# Altium project IMOB_TAG_hv1.PrjPcb
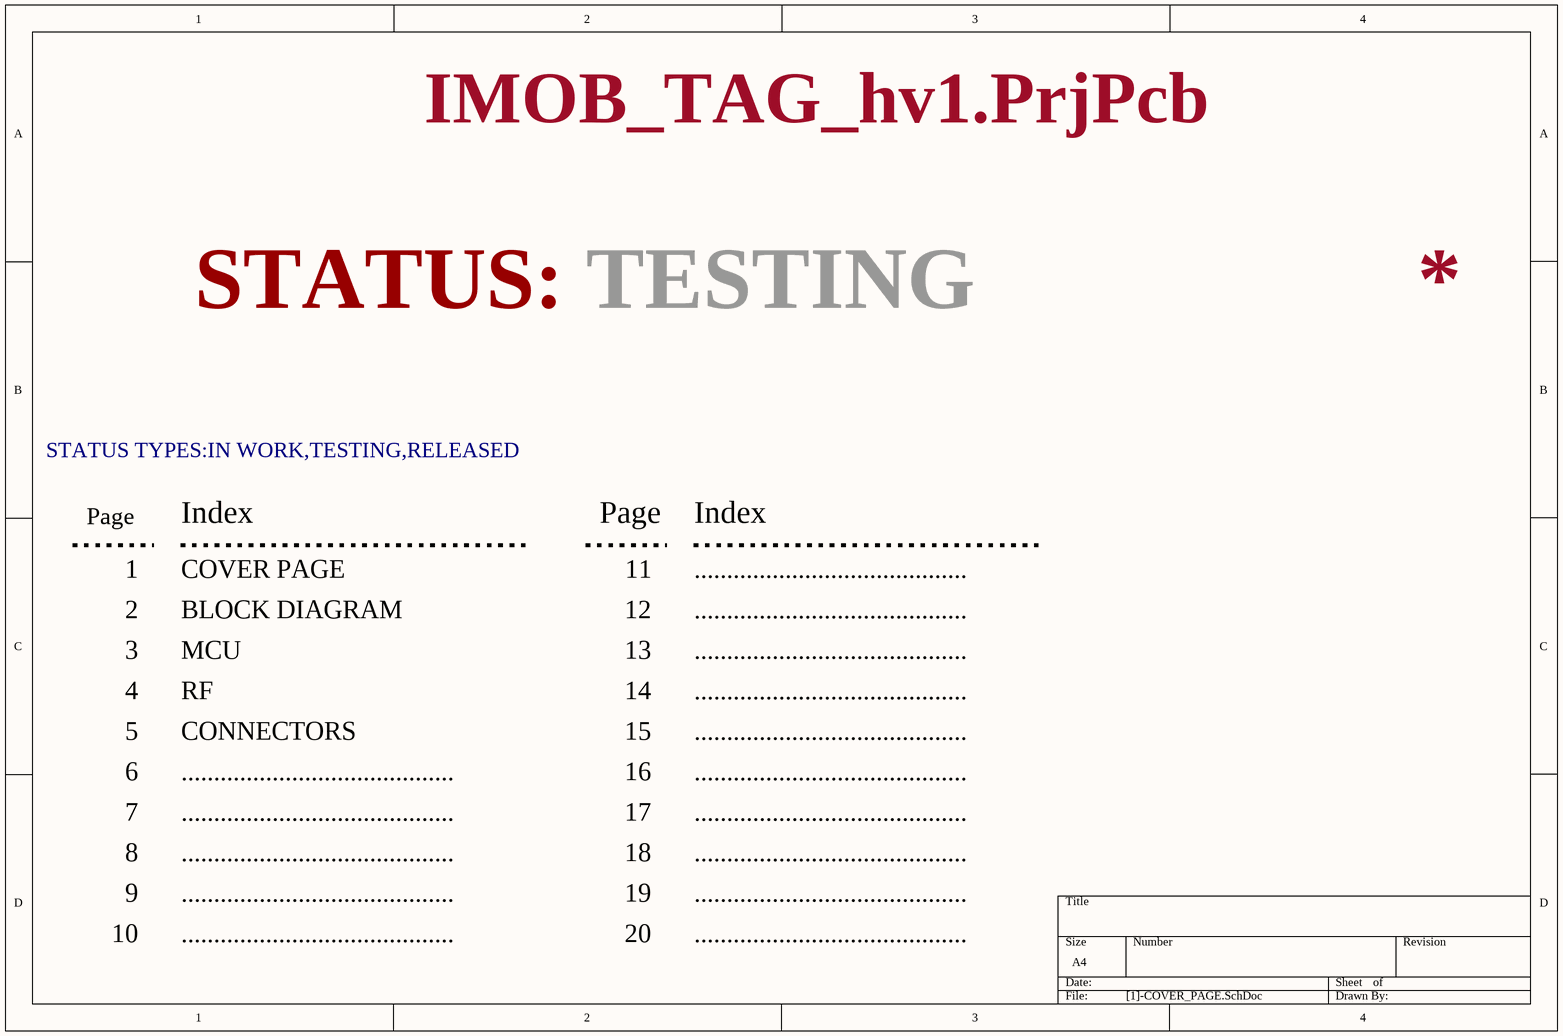
[diagram p0: [1]-COVER_PAGE.SchDoc]
4 sheets, 45 parts. Net scope: flat (ports and power ports of the same name join across sheets).
Board file: IMOB_TAG_hv1.PcbDoc
Sheets:
  [1]-COVER_PAGE.SchDoc
  [3]-MCU.SchDoc
  [4]-RF.SchDoc
  [5]-CONNECTORS.SchDoc

## Sheet [1]-COVER_PAGE.SchDoc
size A4

### Notes on the sheet
- STATUS:
- TESTING
- STATUS TYPES:IN WORK,TESTING,RELEASED
- Page
- 1
- Index
- COVER PAGE
- 11
- ..........................................
- 2
- BLOCK DIAGRAM
- 12
- 3
- 4
- MCU
- RF
- 13
- 14
- 5
- 6
- CONNECTORS
- 15
- 16
- 7
- 17
- 8
- 9
- 18
- 19
- 10
- 20

## Sheet [3]-MCU.SchDoc
size A4
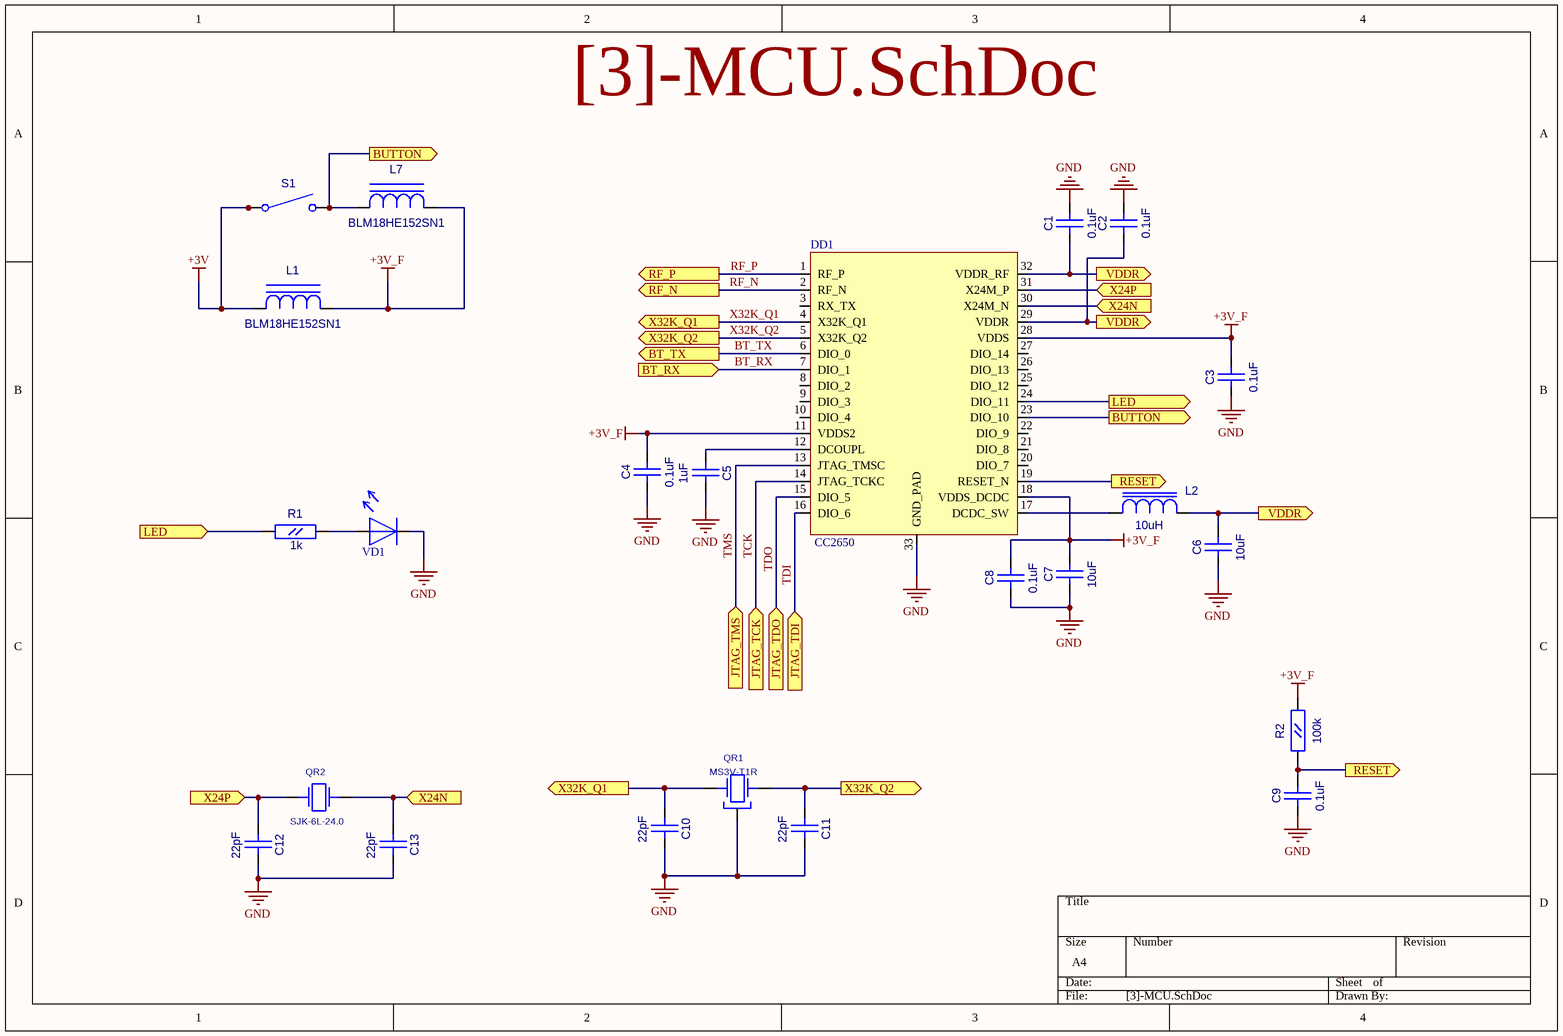
[diagram p1: [3]-MCU.SchDoc]

### Parts
C1  0.1uF  [CC0603]
C2  0.1uF  [CC0603]
C3  0.1uF  [CC0603]
C4  0.1uF  [CC0603]
C5  1uF  [CC0603]
C6  10uF  [CC0805]
C7  10uF  [CC0805]
C8  0.1uF  [CC0603]
C9  0.1uF  [CC0603]
C10  22pF  [CC0603]
C11  22pF  [CC0603]
C12  22pF  [CC0603]
C13  22pF  [CC0603]
DD1  CC2650  [QFN32_TI]
L1  BLM18HE152SN1  [L0603]
L2  10uH  [RC0805]
L7  BLM18HE152SN1  [L0603]
QR1  MS3V-T1R  [MS3V-T1R]
QR2  SJK-6L-24.0  [AC5032_2]
R1  1k  [RC0603]
R2  100k  [RC0603]
S1  IT-1147  [IT-1147]  (value not drawn)
VD1  LED_0805  [LED0805]  (value not drawn)

### Ports
BT_RX (in), BT_TX (out), BUTTON (out), JTAG_TCK (in), JTAG_TDI (in), JTAG_TDO (in), JTAG_TMS (in), LED (in), LED (out), RESET (out), RF_N (out), RF_P (out), VDDR (out), X24N (in), X24P (in), X32K_Q1 (out), X32K_Q2 (out)

### Nets
+3V: L1.1(A) S1.1(C1) S1.2
+3V_F: C3.2(B) C4.2(B) C7.2(B) C8.2(B) DD1.11(VDDS2) DD1.18(VDDS_DCDC) DD1.28(VDDS) L1.2(C) L7.2(C) R2.2(B)
GND: C1.2(B) C2.2(B) C3.1(A) C4.1(A) C5.2(B) C6.1(A) C7.1(A) C8.1(A) C9.1(A) C10.2(B) C11.2(B) C12.2(B) C13.2(B) DD1.33(GND_PAD) QR1.3 VD1.2
BT_RX: DD1.7(DIO_1) ; port BT_RX
BT_TX: DD1.6(DIO_0) ; port BT_TX
RF_N: DD1.2(RF_N) ; port RF_N
RF_P: DD1.1(RF_P) ; port RF_P
TCK: DD1.14(JTAG_TCKC) ; port JTAG_TCK
TDI: DD1.16(DIO_6) ; port JTAG_TDI
TDO: DD1.15(DIO_5) ; port JTAG_TDO
TMS: DD1.13(JTAG_TMSC) ; port JTAG_TMS
X32K_Q1: C10.1(A) DD1.4(X32K_Q1) QR1.2(X2) ; port X32K_Q1
X32K_Q2: C11.1(A) DD1.5(X32K_Q2) QR1.1(X1) ; port X32K_Q2
NetC1_1: C1.1(A) C2.1(A) C6.2(B) DD1.29(VDDR) DD1.32(VDDR_RF) L2.2(B) ; port VDDR
NetC5_1: C5.1(A) DD1.12(DCOUPL)
NetC9_2: C9.2(B) DD1.19(RESET_N) R2.1(A) ; port RESET
NetC12_1: C12.1(A) DD1.31(X24M_P) QR2.1 ; port X24P
NetC13_1: C13.1(A) DD1.30(X24M_N) QR2.2 ; port X24N
NetDD1_17: DD1.17(DCDC_SW) L2.1(A)
NetDD1_23: DD1.23(DIO_10) L7.1(A) S1.3(C2) S1.4 ; port BUTTON
NetDD1_24: DD1.24(DIO_11) R1.1(A) ; port LED
NetR1_2: R1.2(B) VD1.1

Not connected (* = marked no-connect by the designer): DD1 3(RX_TX) 8(DIO_2) 9(DIO_3) 10(DIO_4) 20(DIO_7) 21(DIO_8) 22(DIO_9) 25(DIO_12) 26(DIO_13) 27(DIO_14)

### Library data of the parts
C1-C5 C8-C13 = CC0603
  C1-C4 C8 C9: Value: 0.1uF
  C5: Value: 1uF
  C10-C13: Value: 22pF
C6 C7 = CC0805: Value: 10uF
DD1 = CC2650RHB: CC2650RHBT; Value: CC2650
L1 L7 = L0603: Value: BLM18HE152SN1
L2 = L0805: Value: 10uH
QR1 = MS3V-T1R: CRYSTAL_32768 Hz; Value: *
QR2 = AC5032_2: AC5032/2; Value: SJK-6L-24.0
R1 R2 = RC0603
  R1: Value: 1k
  R2: Value: 100k
S1 = IT-1147: Switch, Single Pole, Single Throw, Normally Open; Value: {Value}
VD1 = LED_0805: Value: LED_0805

## Sheet [4]-RF.SchDoc
size A4
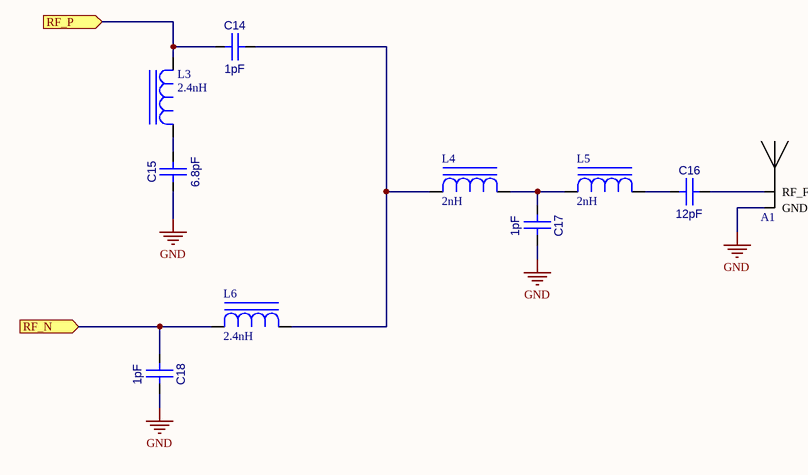
[diagram p2: [4]-RF.SchDoc]

### Parts
A1  Antenna Wi-Fi  [Antenna_WiFi]  (value not drawn)
C14  1pF  [CC0603]
C15  6.8pF  [CC0603]
C16  12pF  [CC0603]
C17  1pF  [CC0603]
C18  1pF  [CC0603]
L3  2.4nH  [L0402]
L4  2nH  [L0402]
L5  2nH  [L0402]
L6  2.4nH  [L0402]

### Ports
RF_N (in), RF_P (in)

### Nets
GND: A1.2(GND) C15.1(A) C17.2(B) C18.2(B)
RF_N: C18.1(A) L6.1(A) ; port RF_N
RF_P: C14.1(A) L3.2(C) ; port RF_P
NetA1_1: A1.1(RF_Feed) C16.2(B)
NetC14_2: C14.2(B) L4.1(A) L6.2(C)
NetC15_2: C15.2(B) L3.1(A)
NetC16_1: C16.1(A) L5.2(C)
NetC17_1: C17.1(A) L4.2(C) L5.1(A)

### Library data of the parts
A1 = Antenna Wi-Fi: 2.43GHz
C14-C18 = CC0603
  C14 C17 C18: Value: 1pF
  C15: Value: 6.8pF
  C16: Value: 12pF
L3-L6 = L0402
  L3 L6: Value: 2.4nH
  L4 L5: Value: 2nH

## Sheet [5]-CONNECTORS.SchDoc
size A4
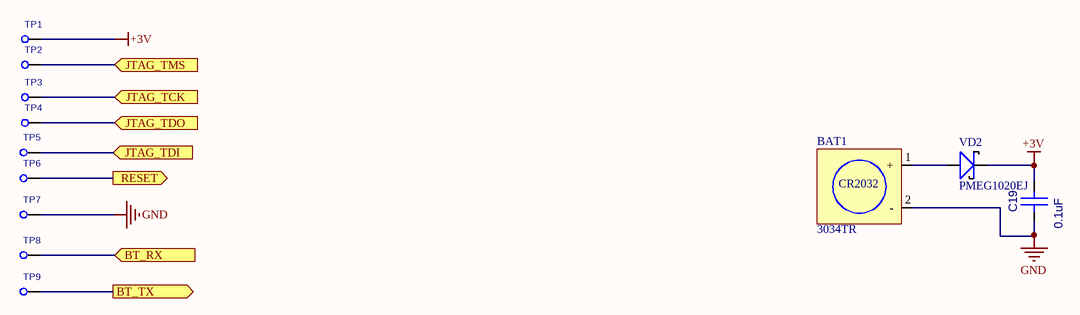
[diagram p3: [5]-CONNECTORS.SchDoc]

### Parts
BAT1  3034TR  [3034-TR]
C19  0.1uF  [CC0603]
TP1  TESTPOINT1  [TESTPOINT1]  (value not drawn)
TP2  TESTPOINT1  [TESTPOINT1]  (value not drawn)
TP3  TESTPOINT1  [TESTPOINT1]  (value not drawn)
TP4  TESTPOINT1  [TESTPOINT1]  (value not drawn)
TP5  TESTPOINT1  [TESTPOINT1]  (value not drawn)
TP6  TESTPOINT1  [TESTPOINT1]  (value not drawn)
TP7  TESTPOINT1  [TESTPOINT1]  (value not drawn)
TP8  TESTPOINT1  [TESTPOINT1]  (value not drawn)
TP9  TESTPOINT1  [TESTPOINT1]  (value not drawn)
VD2  PMEG1020EJ  [SOD323]

### Ports
BT_RX (in), BT_TX (out), JTAG_TCK (in), JTAG_TDI (in), JTAG_TDO (in), JTAG_TMS (in), RESET (out)

### Nets
+3V: C19.2(B) TP1.1 VD2.2(K)
GND: BAT1.2(-) C19.1(A) TP7.1
BT_RX: TP8.1 ; port BT_RX
BT_TX: TP9.1 ; port BT_TX
TCK: TP3.1 ; port JTAG_TCK
TDI: TP5.1 ; port JTAG_TDI
TDO: TP4.1 ; port JTAG_TDO
TMS: TP2.1 ; port JTAG_TMS
NetBAT1_1: BAT1.1(+) VD2.1(A)
NetC9_2: TP6.1 ; port RESET

### Notes on the sheet
- (in symbol 3034) CR2032

### Library data of the parts
BAT1 = 3034: CR2032 holder smd; Value: 3034TR
C19 = CC0603: Value: 0.1uF
VD2 = PMEG2010: Value: PMEG1020EJ
TP1-TP9 = TESTPOINT1: Value: *

## Nets that join several sheets
+3V: [3]-MCU (L1.1 S1.1 S1.2), [5]-CONNECTORS (C19.2 TP1.1 VD2.2)
GND: [3]-MCU (16 pins), [4]-RF (A1.2 C15.1 C17.2 C18.2), [5]-CONNECTORS (BAT1.2 C19.1 TP7.1)
BT_RX: [3]-MCU (DD1.7), [5]-CONNECTORS (TP8.1)
BT_TX: [3]-MCU (DD1.6), [5]-CONNECTORS (TP9.1)
NetC9_2: [3]-MCU (C9.2 DD1.19 R2.1), [5]-CONNECTORS (TP6.1)
RF_N: [3]-MCU (DD1.2), [4]-RF (C18.1 L6.1)
RF_P: [3]-MCU (DD1.1), [4]-RF (C14.1 L3.2)
TCK: [3]-MCU (DD1.14), [5]-CONNECTORS (TP3.1)
TDI: [3]-MCU (DD1.16), [5]-CONNECTORS (TP5.1)
TDO: [3]-MCU (DD1.15), [5]-CONNECTORS (TP4.1)
TMS: [3]-MCU (DD1.13), [5]-CONNECTORS (TP2.1)